# Altium schematic sheet Sheet2.SchDoc
size A4
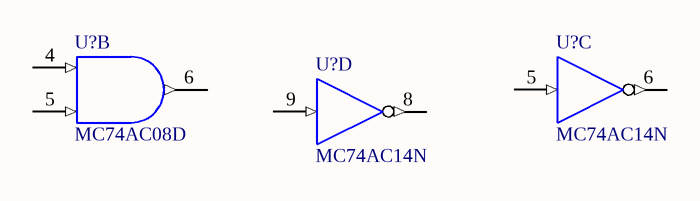
[diagram p0: Sheet2.SchDoc]

## Parts
(Parts that share a designator on the sheet are numbered #1, #2 ... from top to bottom, then left to right.)
U?#1  MC74AC08D  [751A-03_N]  (part B of 4)
U?#2  MC74AC14N  [646-06]  (part C of 6)
U?#3  MC74AC14N  [646-06]  (part D of 6)

## Nets
GND: U?#1.7(GND) U?#2.7(GND) U?#3.7(GND)
VDD: U?#1.14(VDD) U?#2.14(VDD) U?#3.14(VDD)

Not connected (* = marked no-connect by the designer): U?#1 4(A) 5(B) 6(Y); U?#2 5(IN) 6(~{OUT}); U?#3 8(~{OUT}) 9(IN)

## Library data of the parts
U?#1 = MC74AC08D: Quad 2-Input AND Gate; Published: 15-Apr-2002; LatestRevisionDate: 13-Apr-2006; LatestRevisionNote: IPC-7351 Footprint Added.; DatasheetVersion: 9-Apr-1996; PackageReference: 751A-03; Publisher: Altium Limited; PackageDescription: 14-Pin Small Outline Integrated Circuit 1.27 mm Pitch; Code_JEDEC: MS-012-AB; Code_IPC: SOIC127P600-14; ComponentLink1Description: Manufacturer Link; ComponentLink1URL: http://www.onsemi.com/; ComponentLink2Description: Datasheet; ComponentLink2URL: http://www.onsemi.com/pub/Collateral/MC74AC08-D.PDF
U?#2 U?#3 = MC74AC14N: Hex Schmitt-Trigger Inverter; Published: 15-Apr-2002; DatasheetVersion: 9-Apr-1996; PackageVersion: 1995; PackageReference: 646-06; Publisher: Altium Limited; PackageDescription: DIP; 14 Leads; Row Spacing 7.62 mm; Pitch 2.54 mm; ComponentLink1Description: Manufacturer Link; ComponentLink1URL: http://www.onsemi.com/; ComponentLink2Description: Datasheet; ComponentLink2URL: http://www.onsemi.com/pub/Collateral/MC74AC14-D.PDF